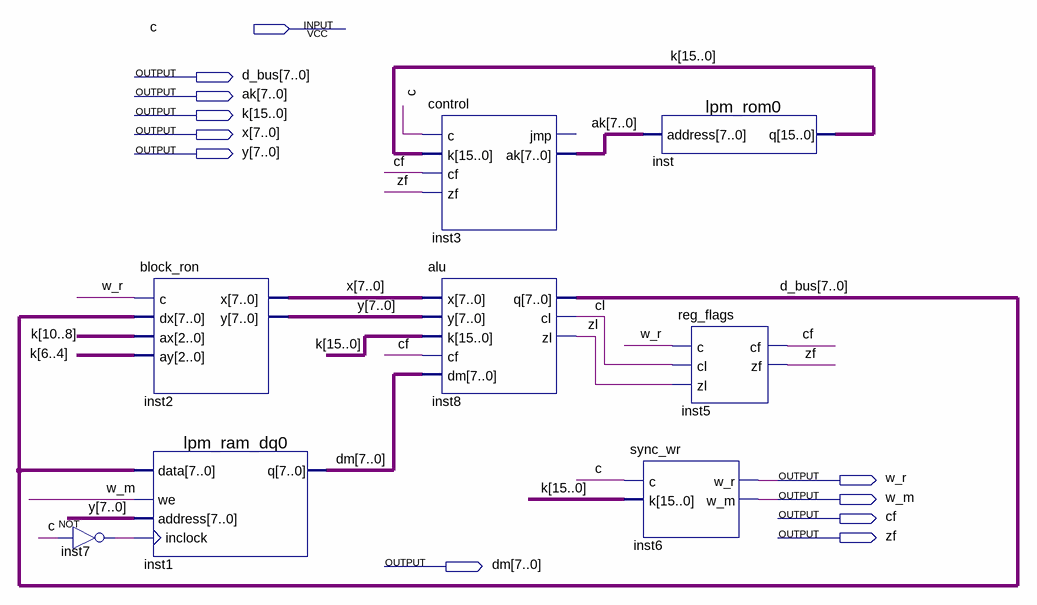
[diagram p0: schematic sheet]
// Quartus schematic processor_project.bdf as structural Verilog: 8 symbols, 11 pins
module processor_project (
  input  c,
  output [7:0] d_bus,
  output [7:0] ak,
  output [15:0] k,
  output [7:0] x,
  output [7:0] y,
  output w_r,
  output w_m,
  output cf,
  output zf,
  output [7:0] dm
);

  wire cl, inst7_out, zl;

  not inst7 (inst7_out, c);
  block_ron inst2 (.c(w_r), .dx(d_bus), .ax(k[10:8]), .ay(k[6:4]), .x(x), .y(y));
  lpm_ram_dq0 inst1 (.data(d_bus), .we(w_m), .address(y), .inclock(inst7_out), .q(dm));
  control inst3 (.c(c), .k(k), .cf(cf), .zf(zf), .ak(ak));  // open: jmp
  alu inst8 (.x(x), .y(y), .k(k), .cf(cf), .dm(dm), .q(d_bus), .cl(cl), .zl(zl));
  lpm_rom0 inst (.address(ak), .q(k));
  reg_flags inst5 (.c(w_r), .cl(cl), .zl(zl), .cf(cf), .zf(zf));
  sync_wr inst6 (.c(c), .k(k), .w_r(w_r), .w_m(w_m));
endmodule
